# EAGLE design board (EAGLE 7.4.0)
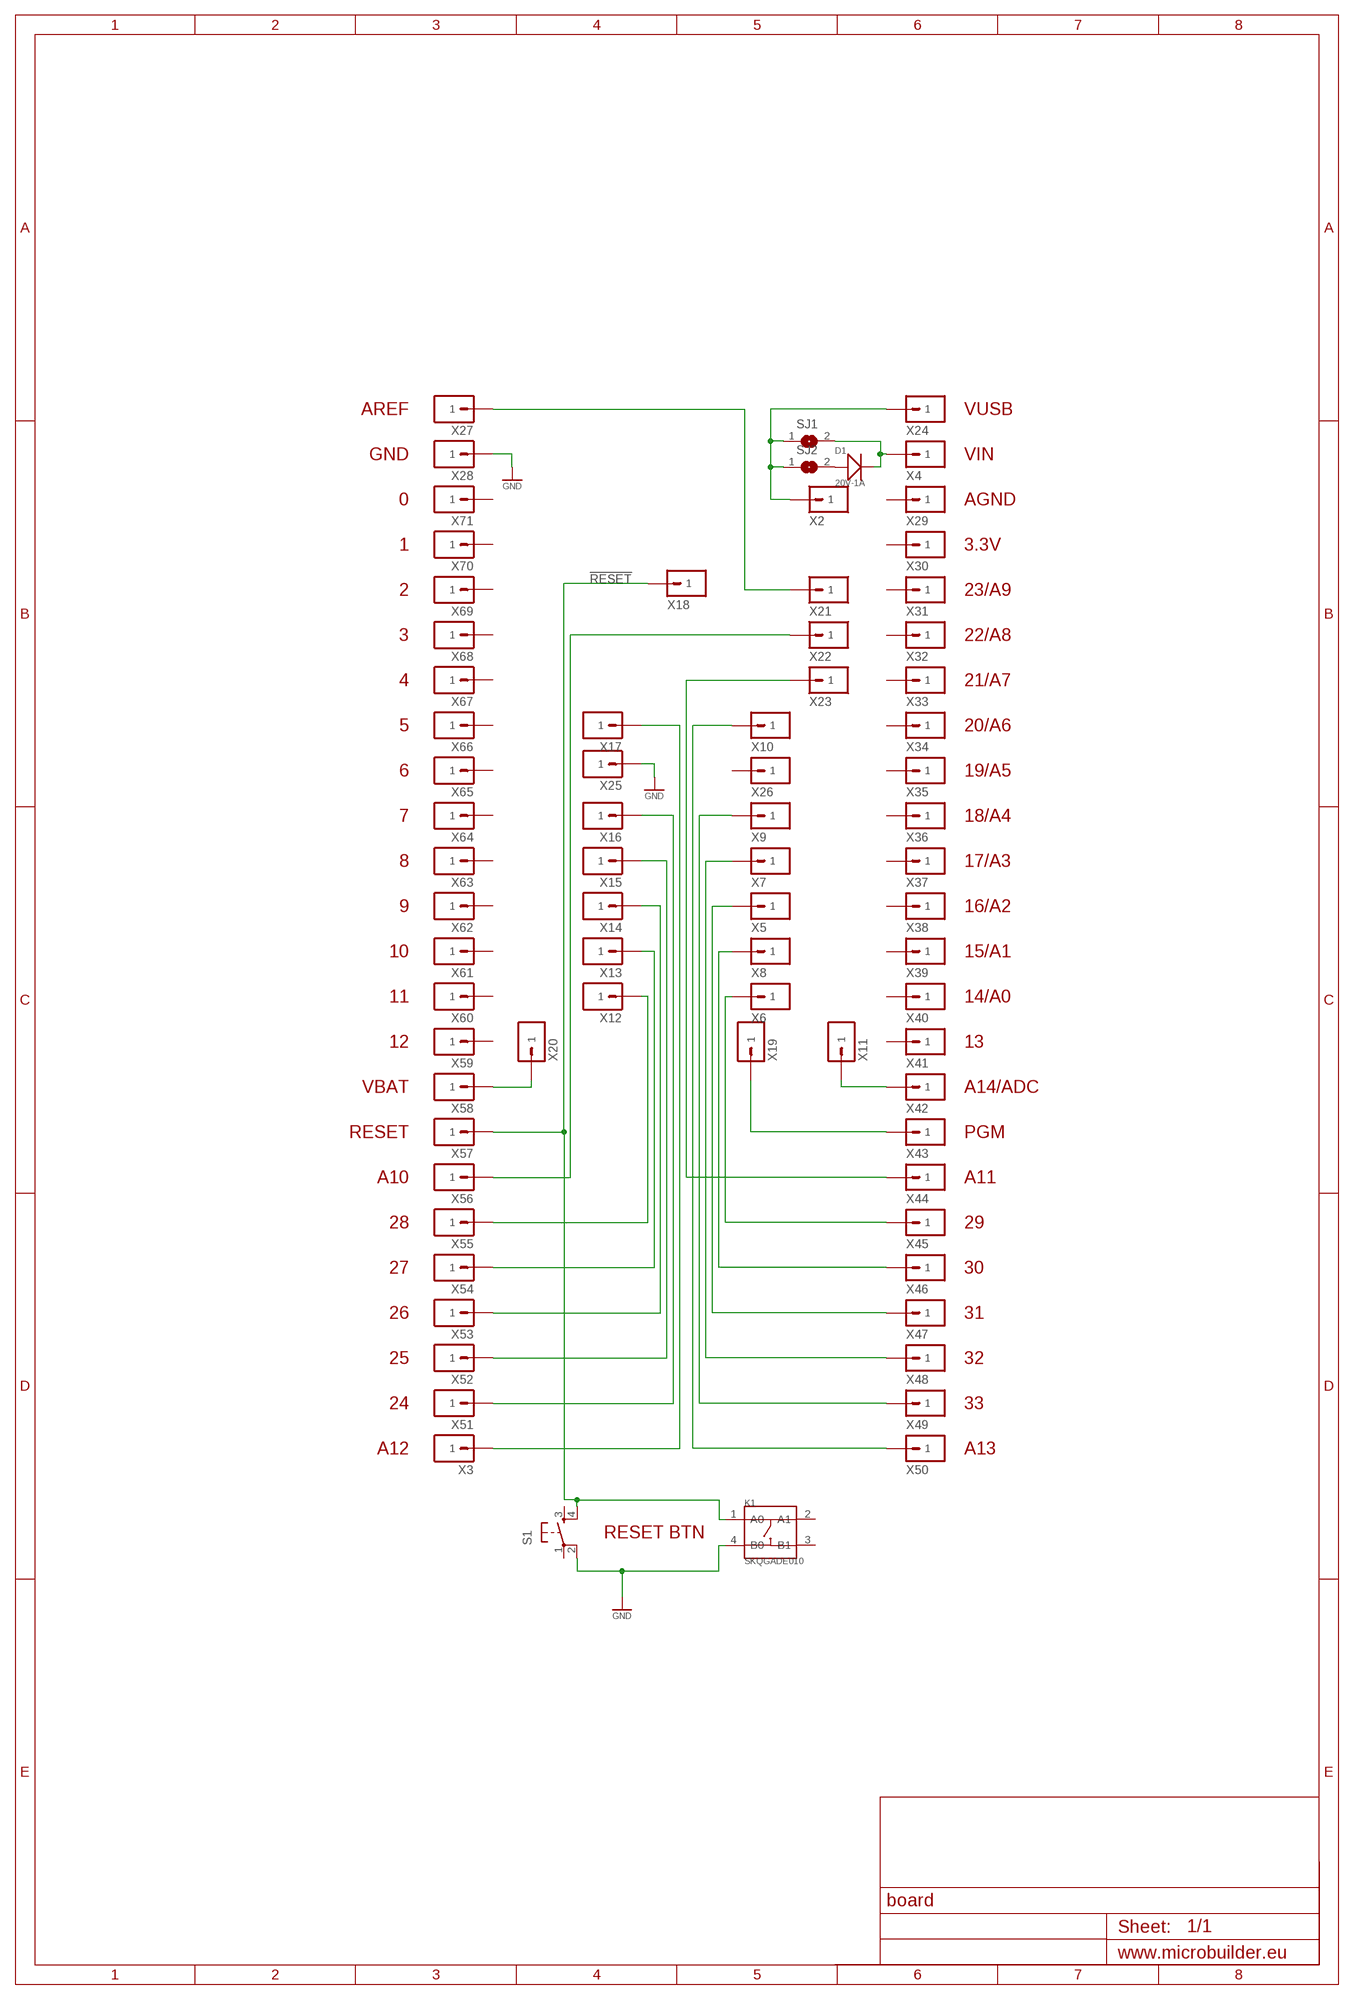
[diagram p0: schematic, sheet 1]

## Parts
D1  20V-1A  SMD-DIODE-SCHOTTKY-20V-1A(SOD-123)  [SOD-123]
K1  SKQGADE010  SMD-SWITCH-TOP-260GF(4P-D5.2MM)  [SW4-SMD-5.2X5.2X1.5MM]
S1  SWITCHPTH_NOSILK  [SWITCH_PTH_NOSILK]
SJ1  SOLDERJUMPER  [SOLDERJUMPER_ARROW_NOPASTE]
SJ2  SOLDERJUMPER  [SOLDERJUMPER_ARROW_NOPASTE]
X2  1P1/MIN_NOSILK  [HEADER_1X1_1/MIN_NOSILK]
X3  1P1/MIN_NOSILK  [HEADER_1X1_1/MIN_NOSILK]
X4  1P1/MIN_NOSILK  [HEADER_1X1_1/MIN_NOSILK]
X5  1P  [1P_X]
X6  1P  [1P_X]
X7  1P  [1P_X]
X8  1P  [1P_X]
X9  1P  [1P_X]
X10  1P  [1P_X]
X11  1P1/MIN_NOSILK  [HEADER_1X1_1/MIN_NOSILK]
X12  1P  [1P_X]
X13  1P  [1P_X]
X14  1P  [1P_X]
X15  1P  [1P_X]
X16  1P  [1P_X]
X17  1P  [1P_X]
X18  1P  [1P_X]
X19  1P1/MIN_NOSILK  [HEADER_1X1_1/MIN_NOSILK]
X20  1P1/MIN_NOSILK  [HEADER_1X1_1/MIN_NOSILK]
X21  1P1/MIN_NOSILK  [HEADER_1X1_1/MIN_NOSILK]
X22  1P1/MIN_NOSILK  [HEADER_1X1_1/MIN_NOSILK]
X23  1P1/MIN_NOSILK  [HEADER_1X1_1/MIN_NOSILK]
X24  1P1/MIN_NOSILK  [HEADER_1X1_1/MIN_NOSILK]
X25  1P  [1P_X]
X26  1P  [1P_X]
X27  1P1/MIN_NOSILK  [HEADER_1X1_1/MIN_NOSILK]
X28  1P1/MIN_NOSILK  [HEADER_1X1_1/MIN_NOSILK]
X29  1P1/MIN_NOSILK  [HEADER_1X1_1/MIN_NOSILK]
X30  1P1/MIN_NOSILK  [HEADER_1X1_1/MIN_NOSILK]
X31  1P1/MIN_NOSILK  [HEADER_1X1_1/MIN_NOSILK]
X32  1P1/MIN_NOSILK  [HEADER_1X1_1/MIN_NOSILK]
X33  1P1/MIN_NOSILK  [HEADER_1X1_1/MIN_NOSILK]
X34  1P1/MIN_NOSILK  [HEADER_1X1_1/MIN_NOSILK]
X35  1P1/MIN_NOSILK  [HEADER_1X1_1/MIN_NOSILK]
X36  1P1/MIN_NOSILK  [HEADER_1X1_1/MIN_NOSILK]
X37  1P1/MIN_NOSILK  [HEADER_1X1_1/MIN_NOSILK]
X38  1P1/MIN_NOSILK  [HEADER_1X1_1/MIN_NOSILK]
X39  1P1/MIN_NOSILK  [HEADER_1X1_1/MIN_NOSILK]
X40  1P1/MIN_NOSILK  [HEADER_1X1_1/MIN_NOSILK]
X41  1P1/MIN_NOSILK  [HEADER_1X1_1/MIN_NOSILK]
X42  1P1/MIN_NOSILK  [HEADER_1X1_1/MIN_NOSILK]
X43  1P1/MIN_NOSILK  [HEADER_1X1_1/MIN_NOSILK]
X44  1P1/MIN_NOSILK  [HEADER_1X1_1/MIN_NOSILK]
X45  1P1/MIN_NOSILK  [HEADER_1X1_1/MIN_NOSILK]
X46  1P1/MIN_NOSILK  [HEADER_1X1_1/MIN_NOSILK]
X47  1P1/MIN_NOSILK  [HEADER_1X1_1/MIN_NOSILK]
X48  1P1/MIN_NOSILK  [HEADER_1X1_1/MIN_NOSILK]
X49  1P1/MIN_NOSILK  [HEADER_1X1_1/MIN_NOSILK]
X50  1P1/MIN_NOSILK  [HEADER_1X1_1/MIN_NOSILK]
X51  1P1/MIN_NOSILK  [HEADER_1X1_1/MIN_NOSILK]
X52  1P1/MIN_NOSILK  [HEADER_1X1_1/MIN_NOSILK]
X53  1P1/MIN_NOSILK  [HEADER_1X1_1/MIN_NOSILK]
X54  1P1/MIN_NOSILK  [HEADER_1X1_1/MIN_NOSILK]
X55  1P1/MIN_NOSILK  [HEADER_1X1_1/MIN_NOSILK]
X56  1P1/MIN_NOSILK  [HEADER_1X1_1/MIN_NOSILK]
X57  1P1/MIN_NOSILK  [HEADER_1X1_1/MIN_NOSILK]
X58  1P1/MIN_NOSILK  [HEADER_1X1_1/MIN_NOSILK]
X59  1P1/MIN_NOSILK  [HEADER_1X1_1/MIN_NOSILK]
X60  1P1/MIN_NOSILK  [HEADER_1X1_1/MIN_NOSILK]
X61  1P1/MIN_NOSILK  [HEADER_1X1_1/MIN_NOSILK]
X62  1P1/MIN_NOSILK  [HEADER_1X1_1/MIN_NOSILK]
X63  1P1/MIN_NOSILK  [HEADER_1X1_1/MIN_NOSILK]
X64  1P1/MIN_NOSILK  [HEADER_1X1_1/MIN_NOSILK]
X65  1P1/MIN_NOSILK  [HEADER_1X1_1/MIN_NOSILK]
X66  1P1/MIN_NOSILK  [HEADER_1X1_1/MIN_NOSILK]
X67  1P1/MIN_NOSILK  [HEADER_1X1_1/MIN_NOSILK]
X68  1P1/MIN_NOSILK  [HEADER_1X1_1/MIN_NOSILK]
X69  1P1/MIN_NOSILK  [HEADER_1X1_1/MIN_NOSILK]
X70  1P1/MIN_NOSILK  [HEADER_1X1_1/MIN_NOSILK]
X71  1P1/MIN_NOSILK  [HEADER_1X1_1/MIN_NOSILK]

## Nets
!RESET: K1.1(A0) S1.4 X18.1 X57.1
GND: K1.4(B0) S1.2 X25.1 X28.1
N$1: X20.1 X58.1
N$2: D1.+ SJ2.2
N$3: X23.1 X44.1
N$4: SJ1.1 SJ2.1 X2.1 X24.1
N$5: X3.1 X17.1
N$6: X16.1 X51.1
N$7: X15.1 X52.1
N$8: X14.1 X53.1
N$9: X13.1 X54.1
N$10: X12.1 X55.1
N$11: X21.1 X27.1
N$12: X10.1 X50.1
N$13: X9.1 X49.1
N$14: X7.1 X48.1
N$15: X5.1 X47.1
N$16: X8.1 X46.1
N$17: X6.1 X45.1
N$18: D1.- SJ1.2 X4.1
N$19: X11.1 X42.1
N$20: X19.1 X43.1
N$21: X22.1 X56.1
Unconnected: K1.2(A1) K1.3(B1) S1.1 S1.3 X26.1 X29.1 X30.1 X31.1 X32.1 X33.1 X34.1 X35.1 X36.1 X37.1 X38.1 X39.1 X40.1 X41.1 X59.1 X60.1 X61.1 X62.1 X63.1 X64.1 X65.1 X66.1 X67.1 X68.1 X69.1 X70.1 X71.1

## Notes on the sheet
- AREF | VUSB
- GND | VIN
- 0 | AGND
- 1 | 3.3V
- 2 | 23/A9
- 3 | 22/A8
- 4 | 21/A7
- 5 | 20/A6
- 6 | 19/A5
- 7 | 18/A4
- 8 | 17/A3
- 9 | 16/A2
- 10 | 15/A1
- 11 | 14/A0
- 12 | 13
- VBAT | A14/ADC
- RESET | PGM
- A10 | A11
- 28 | 29
- 27 | 30
- 26 | 31
- 25 | 32
- 24 | 33
- A12 | A13
- RESET BTN

## Library data of the parts
D1 = Seeed-OPL-Diode:SMD-DIODE-SCHOTTKY-20V-1A(SOD-123): 304020034; MPN: B5819W
K1 = Seeed-OPL-Button:SMD-SWITCH-TOP-260GF(4P-D5.2MM): 311020017
S1 = thewknd:SWITCH
SJ1 SJ2 = microbuilder:SOLDERJUMPER: SMD Solder JUMPER Solder the two pads together to create a connection, or remove the solder to break it. REFLOW - Use this footprint for solder paste and reflow ovens. WAVE - Use this footprint for hand-soldering (larger pads). CLOSED - Has a trace between the two pads to ensure it is closed by default. The trace needs to be cut to disable the jumper, and can be closed again by creating a solder bridge between the two pads.; BOM: EXCLUDE
X2-X71 = TW_pinheader:1P

## Board
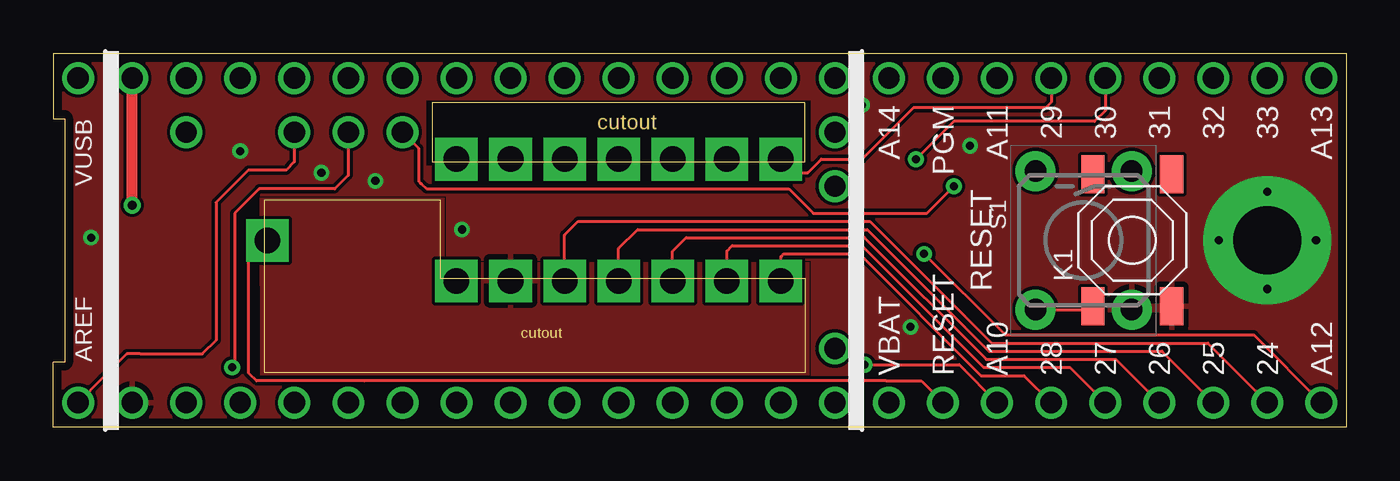
[diagram p1: board, top side]
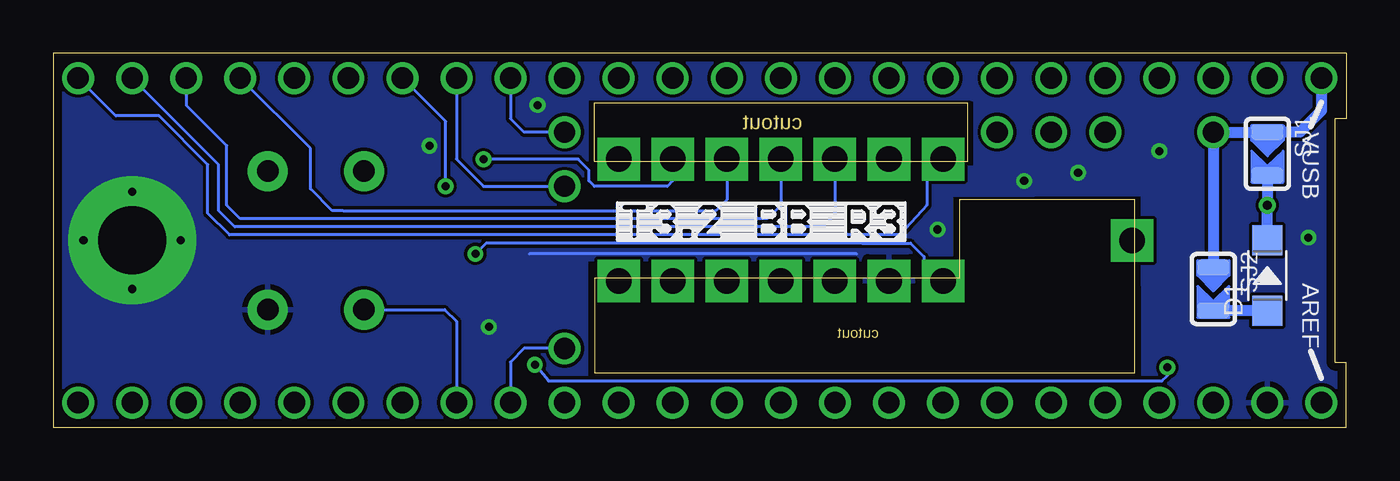
[diagram p2: board, bottom side, seen from below]

Size 60.76 x 17.58 mm. Coordinates in mm from the lower left corner, seen from the top.
Outline: 0,14.5 0.53,14.5 0.53,11.33 0.53,3.07 0,3.07 0,0 60.76,0 60.76,17.58 0,17.58 0,14.5
Copper layers (1*16): Top 0.0356mm / dielectric 1.5011mm / Bottom 0.0356mm
Design rules "oshpark-2layer *": minimum track width 6mil, minimum drill 13mil, track to track 6mil, track to pad 6mil, pad to pad 6mil, via to via 6mil, smd to smd 6mil, copper to edge 15mil, drill to drill 6mil, minimum pad ring 7mil, minimum via ring 7mil, stop-mask expansion 4mil, vias tented up to drill 20mil, thermal gap 10mil
tRestrict: 14 lines
bRestrict: 19 lines
Milling: 12 lines

### Footprints (pad centres in the part's own frame; a part is rotated, then mirrored left to right if it is on the bottom)
SOD-123 = smd 1.397 x 1.397: + -1.651,0; - 1.651,0
SW4-SMD-5.2X5.2X1.5MM = smd 1.8 x 1.1: 1 -3.1,1.85; 2 3.1,1.85; 3 3.1,-1.85; 4 -3.1,-1.85
SWITCH_PTH_NOSILK = drill 1.016 pad 1.88: 1 -3.251,2.261; 2 3.251,2.261; 3 -3.251,-2.261; 4 3.251,-2.261
SOLDERJUMPER_ARROW_NOPASTE = smd 0.762 x 1.524: 1 -1.016,0; 2 1.016,0
HEADER_1X1_1/MIN_NOSILK = drill 1: 1 0,0
1P_X = drill 1.2 pad 2 square: 1 0,0

### Placement (x,y rotation side)
D1  3.71,7.14 90 bottom
K1  50.7,8.79 90 top
S1  48.41,8.79 270 top
SJ1  3.71,12.85 270 bottom
SJ2  6.25,6.5 270 bottom
U$2  [NEG_T3.2_BB_R3]  34.32,8.79 0 bottom
X2  1.17,16.41 0 top
X3  59.59,1.17 0 top
X4  3.71,16.41 0 top
X5  29.11,12.6 0 top
X6  34.19,12.6 0 top
X7  26.57,12.6 0 top
X8  31.65,12.6 0 top
X9  24.03,12.6 0 top
X10  18.95,12.6 0 top
X11  36.73,13.87 90 top
X12  34.19,6.88 180 top
X13  31.65,6.88 180 top
X14  29.11,6.88 180 top
X15  26.57,6.88 180 top
X16  24.03,6.88 180 top
X17  18.95,6.88 180 top
X18  10.06,8.79 0 top
X19  36.73,11.33 90 top
X20  36.73,3.71 90 top
X21  11.33,13.87 0 top
X22  13.87,13.87 0 top
X23  16.41,13.87 0 top
X24  6.25,13.87 0 top
X25  21.49,6.88 0 top
X26  21.49,12.6 0 top
X27  1.17,1.17 0 top
X28  3.71,1.17 0 top
X29  6.25,16.41 0 top
X30  8.79,16.41 0 top
X31  11.33,16.41 0 top
X32  13.87,16.41 0 top
X33  16.41,16.41 0 top
X34  18.95,16.41 0 top
X35  21.49,16.41 0 top
X36  24.03,16.41 0 top
X37  26.57,16.41 0 top
X38  29.11,16.41 0 top
X39  31.65,16.41 0 top
X40  34.19,16.41 180 top
X41  36.73,16.41 180 top
X42  39.27,16.41 180 top
X43  41.81,16.41 180 top
X44  44.35,16.41 180 top
X45  46.89,16.41 180 top
X46  49.43,16.41 180 top
X47  51.97,16.41 180 top
X48  54.51,16.41 180 top
X49  57.05,16.41 180 top
X50  59.59,16.41 180 top
X51  57.05,1.17 0 top
X52  54.51,1.17 0 top
X53  51.97,1.17 0 top
X54  49.43,1.17 0 top
X55  46.89,1.17 0 top
X56  44.35,1.17 0 top
X57  41.81,1.17 0 top
X58  39.27,1.17 0 top
X59  36.73,1.17 0 top
X60  34.19,1.17 0 top
X61  31.65,1.17 0 top
X62  29.11,1.17 0 top
X63  26.57,1.17 0 top
X64  24.03,1.17 0 top
X65  21.49,1.17 0 top
X66  18.95,1.17 0 top
X67  16.41,1.17 0 top
X68  13.87,1.17 0 top
X69  11.33,1.17 0 top
X70  8.79,1.17 0 top
X71  6.25,1.17 0 top

### Tracks (layer width: path | path; a pad name or v marks a point on that pad's centre or on a via)
!RESET
  Top 0.152: X57.1 40.79,2.18 39.14,2.18 14.63,2.18 9.55,2.18 9.17,2.57 9.17,6.5 9.17,7.9 9.42,8.15 X18.1 | 48.59,5.54 K1.1 | 48.59,5.61 K1.1 | S1.4 48.57,5.54 K1.1
  Bottom 0.152: S1.4 42.37,5.54 41.81,4.98 X57.1
GND  (via drill 0.38, 3.2 pad 6)
  Bottom 0.152: 23.01,8.15 38.38,8.15
  other vias: 40.28,4.72 19.2,9.3 15.14,11.58 1.78,8.92 12.6,11.96 57.05,8.79 54.76,8.79 57.05,11.07 59.33,8.79 57.05,6.5 38,15.14 43.08,13.23 8.79,12.98
  pour Top: -3.91,20.85 -3.91,-4.55 73.56,-4.55 73.56,20.85
  pour Bottom: -1.37,19.58 -1.37,-1.37 72.29,-1.37 72.29,19.58
N$1
  Bottom 0.152: X20.1 38.63,3.71 39.27,3.07 X58.1
N$2
  Bottom 0.508: D1.+ SJ2.2
N$3  (via drill 0.38)
  Top 0.152: X23.1 17.04,13.23 17.17,13.11 17.17,12.34 17.17,11.58 17.3,11.46 17.55,11.2 34.57,11.2 35.71,10.06 41.05,10.06 v42.32,11.33
  Bottom 0.152: X44.1 42.82,14.88 42.32,14.38 v42.32,11.33
N$4
  Bottom 0.508: X2.1 1.17,14.88 2.18,13.87 SJ1.1 X24.1 SJ2.1
N$5  (via drill 0.38)
  Top 0.152: X3.1 56.41,4.34 44.73,4.34 v40.92,8.15
  Bottom 0.152: v40.92,8.15 40.41,8.66 22.76,8.66 20.47,8.66 19.84,8.03 19.84,7.77 X17.1
N$6
  Top 0.152: X16.1 24.03,9.04 24.66,9.68 38.38,9.68 44.09,3.96 54.25,3.96 X51.1
N$7
  Top 0.152: X15.1 26.57,8.41 27.46,9.3 38.25,9.3 43.97,3.58 52.1,3.58 X52.1
N$8
  Top 0.152: X14.1 29.11,8.28 29.74,8.92 38.13,8.92 43.84,3.2 49.94,3.2 X53.1
N$9
  Top 0.152: X13.1 31.65,8.28 31.9,8.53 38,8.53 43.71,2.82 47.78,2.82 X54.1
N$10
  Top 0.152: X55.1 45.62,2.44 43.59,2.44 37.87,8.15 34.82,8.15 34.32,8.15 34.19,8.03 X12.1
N$11
  Top 0.152: X27.1 2.31,2.31 3.45,3.45 4.09,3.45 7.01,3.45 7.65,4.09 7.65,10.57 9.17,12.09 10.95,12.09 11.33,12.47 X21.1
N$12
  Bottom 0.152: X10.1 18.95,12.47 19.71,11.71 19.71,10.44 20.98,9.04 52.48,9.04 53.49,10.06 53.49,12.34 55.78,14.63 57.81,14.63 X50.1
N$13
  Bottom 0.152: X9.1 24.03,10.06 24.54,9.42 52.22,9.42 52.98,10.19 52.98,12.34 X49.1
N$14
  Bottom 0.152: X7.1 26.57,10.44 27.2,9.8 51.97,9.8 52.6,10.44 52.6,13.23 54.51,15.14 X48.1
N$15
  Bottom 0.152: X5.1 29.11,10.69 29.62,10.19 47.14,10.19 47.65,10.19 48.67,11.2 48.67,13.11 X47.1
N$16  (via drill 0.38)
  Top 0.152: X46.1 49.43,14.88 48.92,14.38 42.32,14.38 v40.54,12.6
  Bottom 0.152: X8.1 31.65,11.58 31.9,11.33 35.33,11.33 35.59,11.58 35.59,12.09 36.09,12.6 39.27,12.6 v40.54,12.6
N$17
  Top 0.152: X6.1 34.82,11.96 35.46,11.96 36.09,12.6 38,12.6 39.27,13.87 40.41,15.01 46.63,15.01 46.89,15.27 X45.1
N$18  (via drill 0.43)
  Top 0.508: v3.71,10.44 X4.1
  Bottom 0.508: D1.- v3.71,10.44 SJ1.2
N$19
  Bottom 0.152: X11.1 38.63,13.87 39.27,14.5 X42.1
N$20
  Bottom 0.152: X19.1 39.9,11.33 40.54,11.33 41.81,12.6 X43.1
N$21  (via drill 0.38)
  Top 0.152: v38.13,2.95 42.57,2.95 X56.1 | X22.1 13.87,11.84 13.23,11.2 9.68,11.2 8.53,10.06 8.53,6.38 8.53,2.95 v8.41,2.82
  Bottom 0.152: v38.13,2.95 37.49,2.18 8.66,2.18 8.41,2.44 v8.41,2.82

### Text on the board
Dimension: cutout | cutout
tPlace: VUSB | A14 | PGM | A11 | 29 | 30 | 31 | 32 | 33 | A13 | RESET | AREF | VBAT | RESET | A10 | 28 | 27 | 26 | 25 | 24 | A12
bPlace: VUSB | AREF
TXT: VUSB | VIN | AGND | 3V3 | A9 | A8 | A7 | A6 | A5 | A4 | A3 | A2 | A1 | A0 | 13 | A14 | PGM | A11 | 29 | 30 | 31 | 32 | 33 | A13 | RESET | AREF | GND | 0 | 1 | 2 | 3 | 4 | 5 | 6 | 7 | 8 | 9 | 10 | 11 | 12 | VBAT | RESET | A10 | 28 | 27 | 26 | 25 | 24 | A12 | all dimensions are in millimeters
paintme: solder jumper | solder jumper